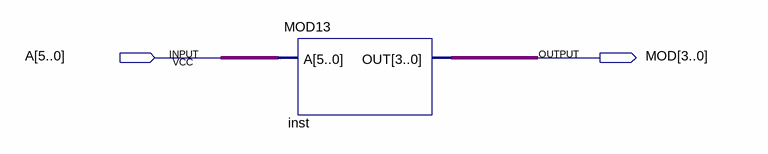
[diagram p0: schematic sheet]
// Quartus schematic g08_Modulo_13.bdf as structural Verilog: 1 symbols, 2 pins
module g08_Modulo_13 (
  input  [5:0] A,
  output [3:0] MOD
);

  MOD13 inst (.A(A), .OUT(MOD));
endmodule
